# EAGLE design Grove - Barometer Sensor v1.0b (EAGLE 6.3)
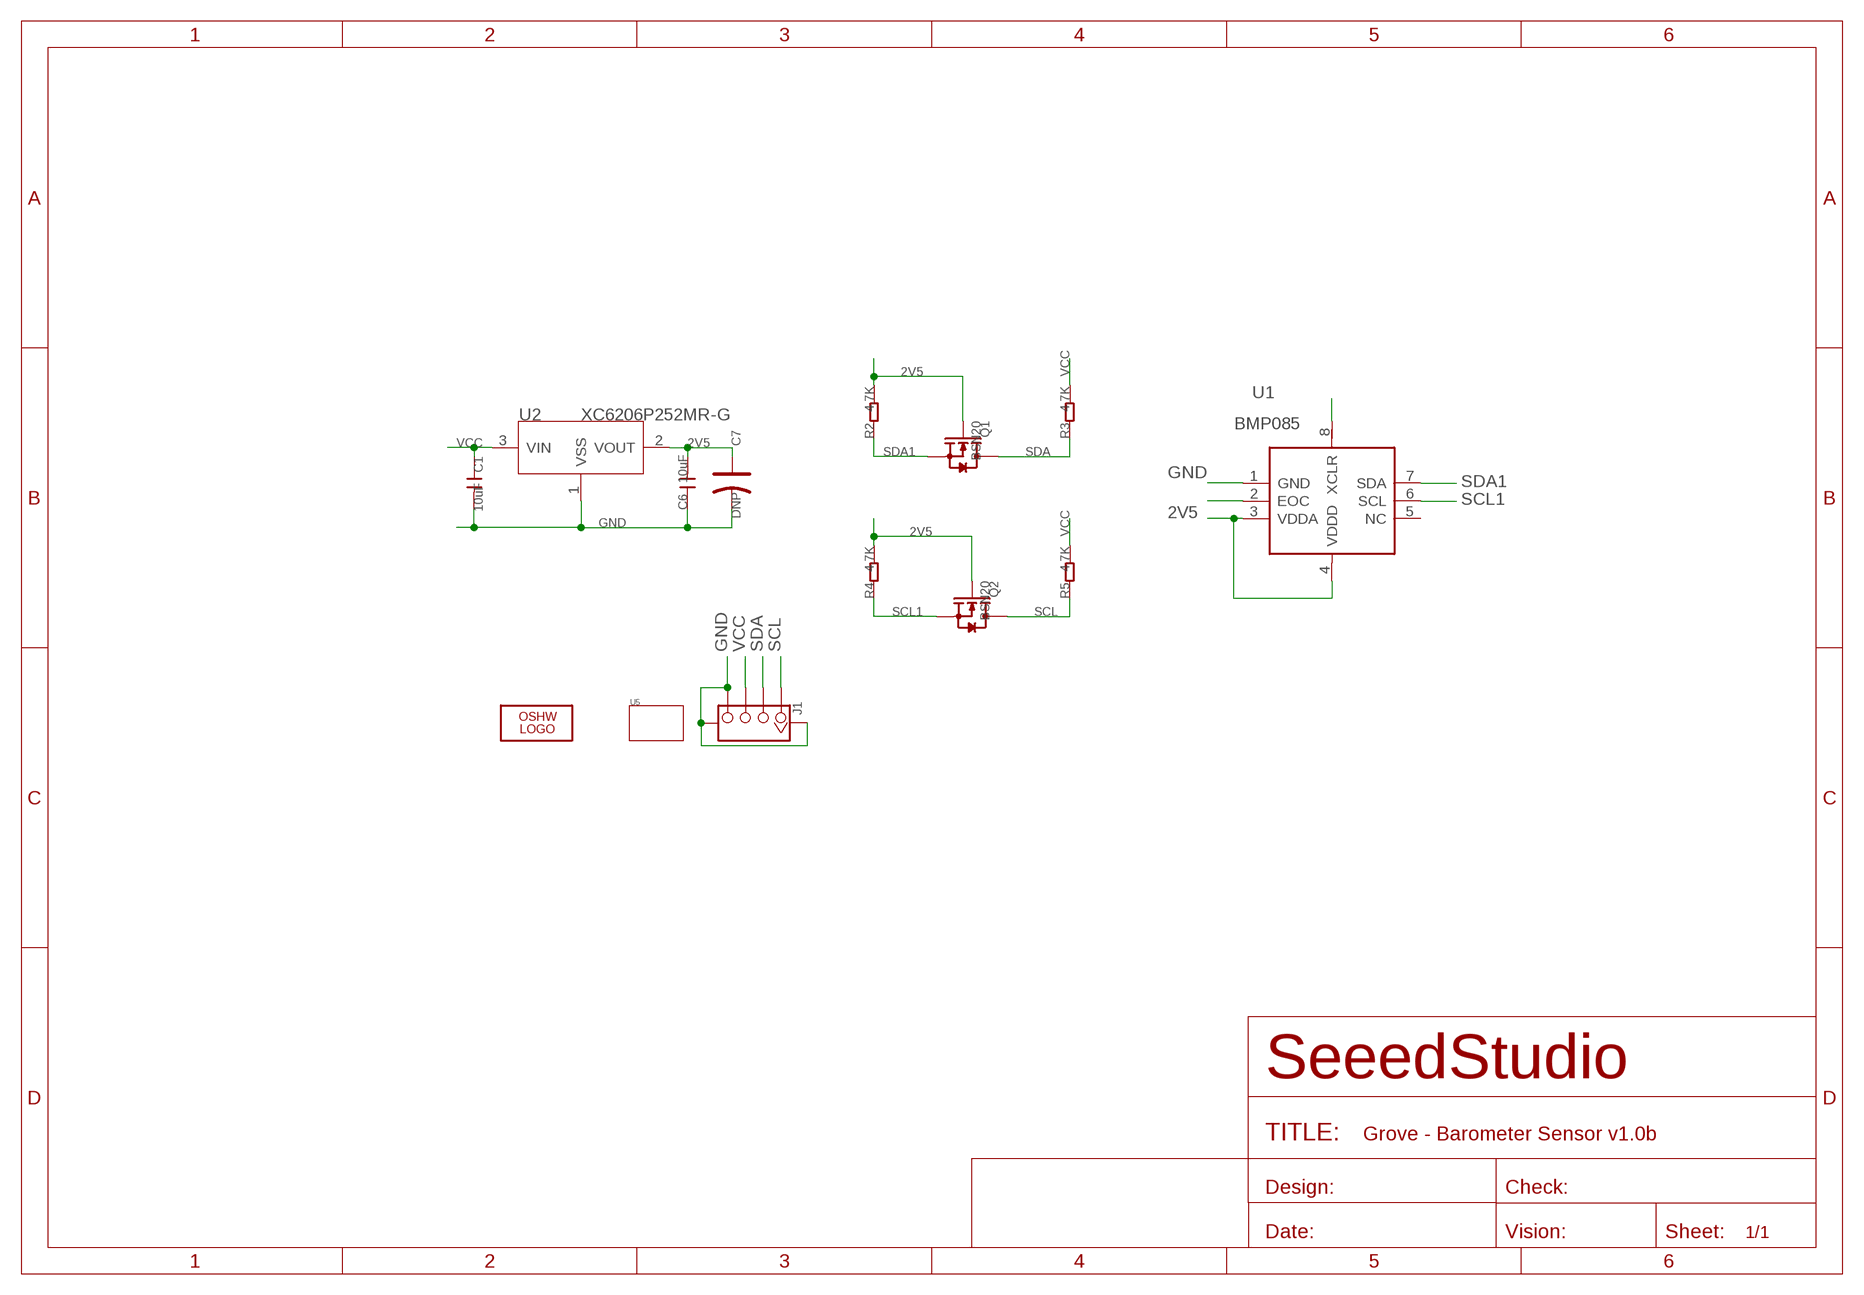
[diagram p0: schematic, sheet 1]

## Parts
C1  10uF  C-0805  [C0805]
C6  10uF  C-0805  [C0805]
C7  DNP  CAP-AVX-A  [AVX-A]
J1  TWIG-4P-2.0-SMD-FEMALE-REINFORCE'DD'  [4P-SMD-2.0]
LOGO2  LOGO-OSHW-FILLX0200-NT  [OSHW_FILLX200_NOTEXT]
Q1  BSN20  MOSFET-N'SOT23'  [SOT23]
Q2  BSN20  MOSFET-N'SOT23'  [SOT23]
R2  4.7K  R-0603  [R0603]
R3  4.7K  R-0603  [R0603]
R4  4.7K  R-0603  [R0603]
R5  4.7K  R-0603  [R0603]
U1  BMP085  [LCC8]
U2  XC6206P252MR-G  XC6206MR  [SOT23]
U5  TWIG-1U  [1U-DIM-W/-DRILL]

## Nets
2V5: C6.2 C7.+ Q1.1(G) Q2.1(G) R2.2 R4.2 U1.3(VDDA) U1.4(VDDD) U2.2(VOUT)
GND: C1.2 C6.1 C7.- J1.4 J1.SS1 J1.SS2 U1.1(GND) U2.1(VSS)
N$1: U1.2(EOC)
N$4: U1.8(XCLR)
SCL: J1.1 Q2.3(D) R5.1
SCL1: Q2.2(S) R4.1 U1.6(SCL)
SDA: J1.2 Q1.3(D) R3.1
SDA1: Q1.2(S) R2.1 U1.7(SDA)
VCC: C1.1 J1.3 R3.2 R5.2 U2.3(VIN)
Unconnected: U1.5(NC)

## Library data of the parts
C1 C6 = Discrete:C*: Ceramic Capacitors
C7 = Discrete:CAP*: Electrolytic Capacitors,Tantalum Capacitors and Super Capacitors
J1 = Connector:TWIG-4P-2.0-SMD-FEMALE-REINFORCE
LOGO2 = Logo:LOGO-OSHW-FILL
Q1 Q2 = Discrete:MOSFET-N: IRLL014: http://www.vishay.com/docs/91319/sihll014.pdf
R2-R5 = Discrete:R*
U1 = IC:BMP085: Digital pressure sensor http://www.bosch-sensortec.com/content/language4/downloads/BST-BMP085-DS000-06.pdf
U2 = IC:XC6206: LOW ESR Cap.Compatible Positive Voltage Regulators
U5 = Module:TWIG

## Board
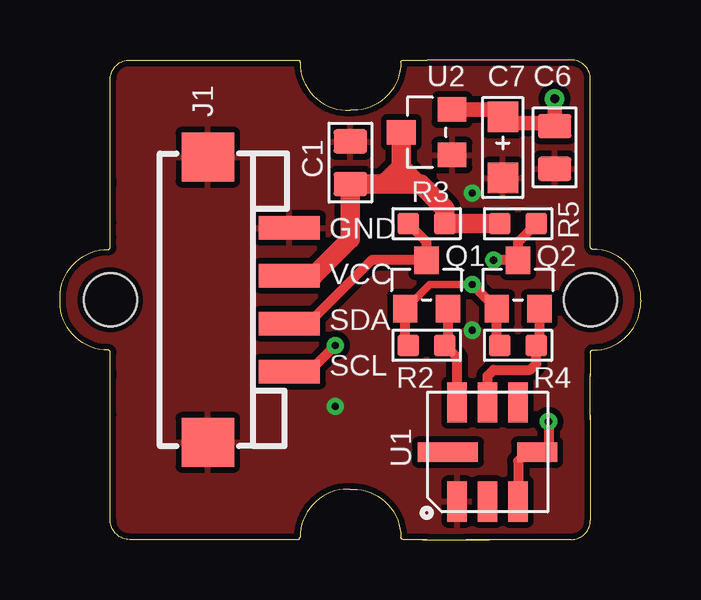
[diagram p1: board, top side]
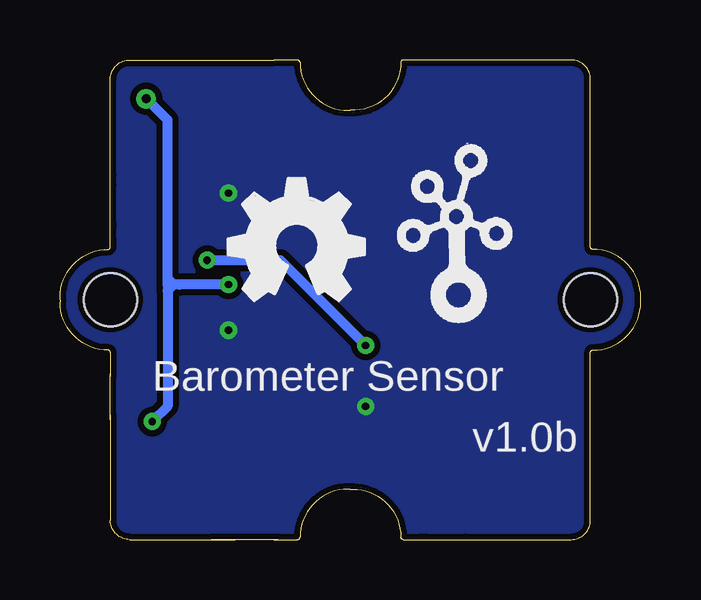
[diagram p2: board, bottom side, seen from below]

Size 24.2 x 20 mm. Coordinates in mm from the lower left corner, seen from the top.
Copper layers (1*16): Top 0.035mm / dielectric 1.5mm / Bottom 0.035mm
Design rules "default *": minimum track width 6mil, minimum drill 12mil, track to track 8mil, track to pad 8mil, pad to pad 8mil, via to via 8mil, smd to smd 0mil, copper to edge 4mil, drill to drill 8mil, minimum pad ring 10mil, minimum via ring 8mil, stop-mask expansion 4mil, vias tented up to drill 100mil, thermal gap 10mil

### Footprints (pad centres in the part's own frame; a part is rotated, then mirrored left to right if it is on the bottom)
C0805 = smd 1.016 x 1.397: 1 -0.889,0; 2 0.889,0
AVX-A = smd 1.27 x 1.27: + -1.27,0; - 1.27,0
4P-SMD-2.0 = smd 0.965 x 2.54: 1 -3,0; 2 -1,0; 3 1,0; 4 3,0 | smd 2.032 x 2.184: SS1 -5.946,3.4; SS2 5.946,3.4
SOT23 = smd 1.016 x 1.143: 1 -0.889,-1.016; 2 0.889,-1.016; 3 0,1.016
R0603 = smd 0.889 x 0.889: 1 -0.762,0; 2 0.762,0
LCC8 = smd 1.67 x 0.8: 1 -2.065,1.27; 2 -2.065,0; 3 -2.065,-1.27; 5 2.065,-1.27; 6 2.065,0; 7 2.065,1.27 | smd 0.8 x 1.67: 4 0,-2.065 | smd 0.8 x 2.5: 8 0,1.65
SOT23' = smd 1.016 x 1.2: 1 -0.95,-1.06; 2 0.95,-1.06; 3 0,1.06
1U-DIM-W/-DRILL = hole 2.2: 0,-10; 0,10

### Placement (x,y rotation side)
C1  12.1,15.71 90 top
C6  20.61,16.35 90 top
C7  18.45,16.35 270 top
J1  9.56,10 90 top
LOGO2  17.18,9.97 0 bottom
Q1  15.27,10.63 0 top
Q2  19.09,10.63 0 top
R2  15.27,8.1 180 top
R3  15.27,13.18 0 top
R4  19.09,8.1 180 top
R5  19.09,13.18 180 top
U1  17.81,3.65 90 top
U2  XC6206P252MR-G  [SOT23']  15.27,16.98 90 top
U5  12.1,10 90 top
U$1  [TWIGLOGO]  7.65,10 0 bottom

### Tracks (layer width: path | path; a pad name or v marks a point on that pad's centre or on a via)
2V5  (via drill 0.3 pad 0.64, 0.38 pad 0.81)
  Top 0.305: v17.18,10.63 15.4,10.63 Q1.1
  Top 0.406: U1.3 19.09,3.27 19.47,3.65 U1.4 20.1,3.65 20.36,3.9 v20.36,4.92 | v17.18,10.63 Q2.1 18.2,8.22 | 14.39,8.22 Q1.1
  Top 0.61: U2.2 18.13,17.93 C7.+ 18.7,17.37 20.61,17.37 | 14.39,8.22 R2.2 | 18.2,8.22 R4.2 | C6.2 20.61,17.37 | 20.61,17.37 v20.61,18.38
  Bottom 0.406: 19.72,10.63 19.72,10.38 | 19.72,10.38 19.72,5.55 v20.36,4.92 | v17.18,10.63 19.21,10.63 19.47,10.63 | 19.47,10.63 19.72,10.63 | 19.72,10.63 19.72,10.89 | 19.72,10.89 19.72,17.49 v20.61,18.38 | 19.47,10.63 19.72,10.89 | 19.47,10.63 19.72,10.38
GND  (via drill 0.3 pad 0.64)
  other vias: 17.18,8.73 11.46,5.55 17.18,14.45
  pour Top (isolate 0.254): -0.47,22.45 24.93,22.45 24.93,-2.95 -0.47,-2.95
  pour Bottom (isolate 0.254): -0.47,22.45 24.93,22.45 24.93,-2.95 -0.47,-2.95
SCL  (via drill 0.3 pad 0.64)
  Top 0.406: R5.1 19.09,12.41 Q2.3 v18.07,11.65 | v11.46,8.1 10.32,6.95 9.61,6.95 J1.1
  Bottom 0.406: v18.07,11.65 15.02,11.65 v11.46,8.1
SCL1
  Top 0.406: Q2.2 19.97,8.22 R4.1 19.85,7.33 19.59,7.08 18.07,7.08 17.81,6.83 U1.6
SDA
  Top 0.406: J1.2 9.67,9.11 10.45,9.11 12.99,11.65 Q1.3 15.27,12.41 R3.1
SDA1
  Top 0.406: Q1.2 16.16,8.22 R2.1 16.55,7.59 U1.7
VCC
  Top 0.813: J1.3 9.58,11.02 10.58,11.02 12.1,12.54 C1.1 14.26,14.83 | 14.26,14.83 14.89,14.83 | U2.3 14.21,14.87 14.26,14.83 | 14.89,14.83 15.02,14.83 16.04,13.81 R3.2 R5.2 | 14.89,14.83 14.26,15.46 14.13,15.46 13.62,14.95

### Text on the board
tPlace: GND | VCC | SDA | SCL
bPlace: Barometer Sensor | v1.0b